# Altium schematic sheet LDv6.1_TOP.SchDoc
size A
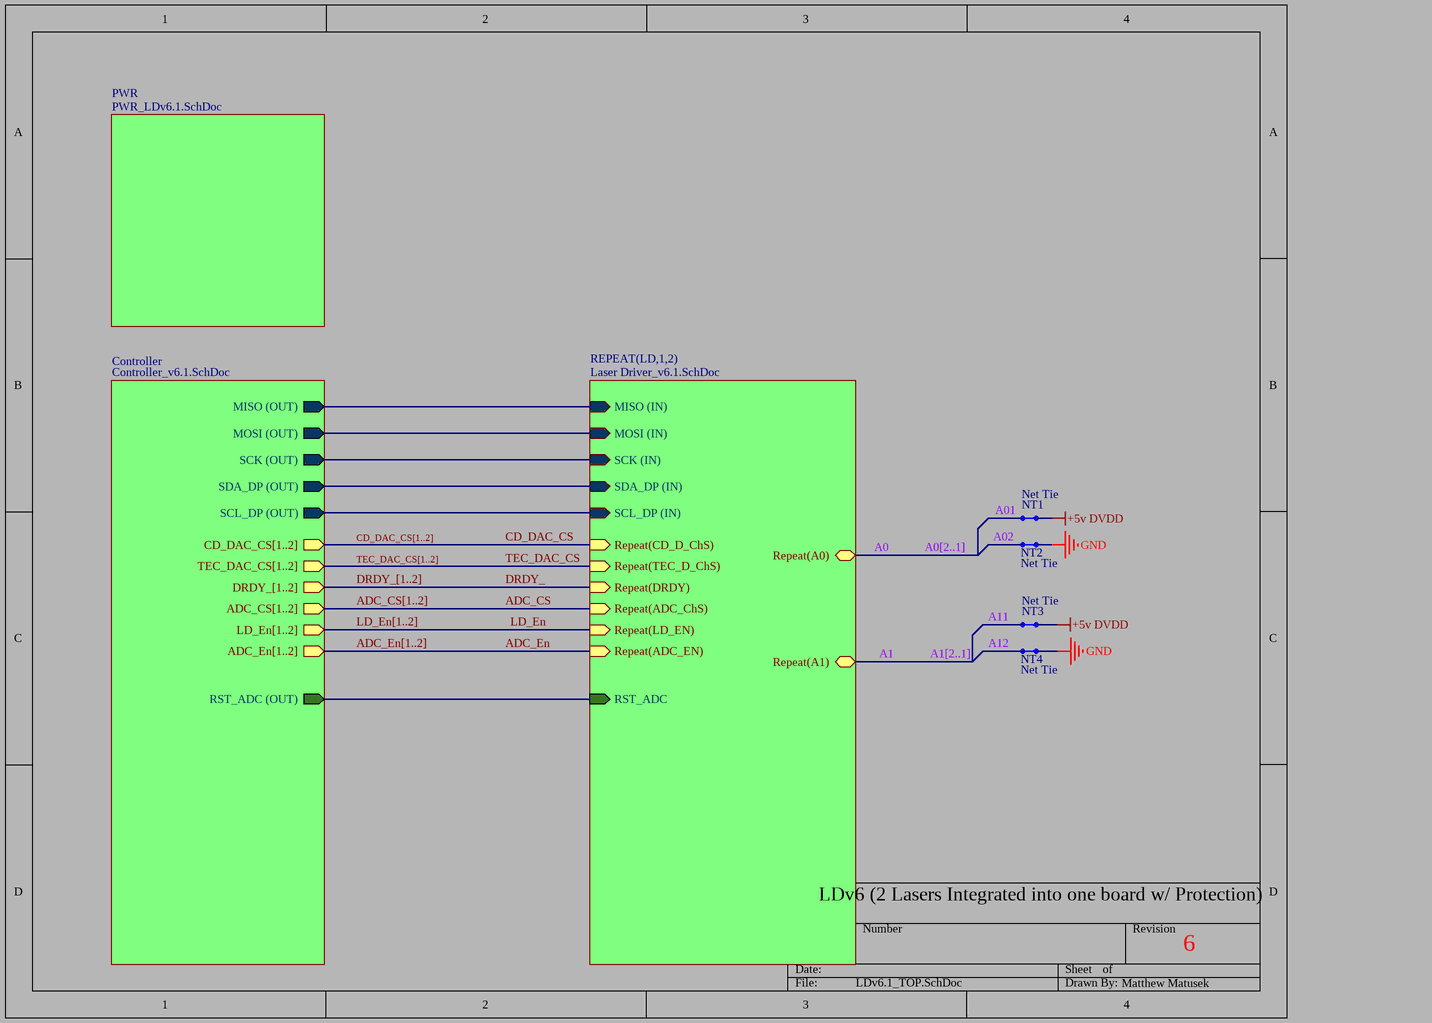
[diagram p0: LDv6.1_TOP.SchDoc]

## Parts
NT1  Net Tie  [Net Tie]  (net tie, no BOM)
NT2  Net Tie  [Net Tie]  (net tie, no BOM)
NT3  Net Tie  [Net Tie]  (net tie, no BOM)
NT4  Net Tie  [Net Tie]  (net tie, no BOM)

## Sub-sheets
Controller = Controller_v6.1.SchDoc: SCK (OUT) (out), MOSI (OUT) (out), MISO (OUT) (out), RST_ADC (OUT) (out), SDA_DP (OUT) (out), SCL_DP (OUT) (out), CD_DAC_CS[1..2] (out), TEC_DAC_CS[1..2] (out), DRDY_[1..2] (out), ADC_CS[1..2] (out), LD_En[1..2] (out), ADC_En[1..2] (out)
PWR = PWR_LDv6.1.SchDoc: no entries
REPEAT(LD,1,2) = Laser Driver_v6.1.SchDoc: RST_ADC (in), Repeat(A0) (bidir), Repeat(A1) (bidir), SDA_DP (IN) (in), MISO (IN) (in), MOSI (IN) (in), SCK (IN) (in), SCL_DP (IN) (in), Repeat(CD_D_ChS) (in), Repeat(DRDY) (in), Repeat(ADC_EN) (in), Repeat(ADC_ChS) (in), Repeat(TEC_D_ChS) (in), Repeat(LD_EN) (in)

## Nets
+5v DVDD: NT1.2 NT3.2
GND: NT2.2 NT4.2
A0: sheet REPEAT(LD,1,2)/Repeat(A0)
A01: NT1.1
A1: sheet REPEAT(LD,1,2)/Repeat(A1)
A02: NT2.1
A11: NT3.1
A12: NT4.1
ADC_CS: sheet REPEAT(LD,1,2)/Repeat(ADC_ChS)
ADC_En: sheet REPEAT(LD,1,2)/Repeat(ADC_EN)
CD_DAC_CS: sheet REPEAT(LD,1,2)/Repeat(CD_D_ChS)
DRDY_: sheet REPEAT(LD,1,2)/Repeat(DRDY)
LD_En: sheet REPEAT(LD,1,2)/Repeat(LD_EN)
TEC_DAC_CS: sheet REPEAT(LD,1,2)/Repeat(TEC_D_ChS)
(unnamed): sheet Controller/SCK (OUT), sheet REPEAT(LD,1,2)/SCK (IN)
(unnamed): sheet Controller/MOSI (OUT), sheet REPEAT(LD,1,2)/MOSI (IN)
(unnamed): sheet Controller/MISO (OUT), sheet REPEAT(LD,1,2)/MISO (IN)
(unnamed): sheet Controller/RST_ADC (OUT), sheet REPEAT(LD,1,2)/RST_ADC
(unnamed): sheet Controller/SDA_DP (OUT), sheet REPEAT(LD,1,2)/SDA_DP (IN)
(unnamed): sheet Controller/SCL_DP (OUT), sheet REPEAT(LD,1,2)/SCL_DP (IN)

## Buses and harness runs
bus A0[2..1]
bus A1[2..1]
bus ADC_CS[1..2] = sheet Controller/ADC_CS[1..2]
bus ADC_En[1..2] = sheet Controller/ADC_En[1..2]
bus CD_DAC_CS[1..2] = sheet Controller/CD_DAC_CS[1..2]
bus DRDY_[1..2] = sheet Controller/DRDY_[1..2]
bus LD_En[1..2] = sheet Controller/LD_En[1..2]
bus TEC_DAC_CS[1..2] = sheet Controller/TEC_DAC_CS[1..2]

## Notes on the sheet
- LDv6 (2 Lasers Integrated into one board w/ Protection)
- 6
- Matthew Matusek